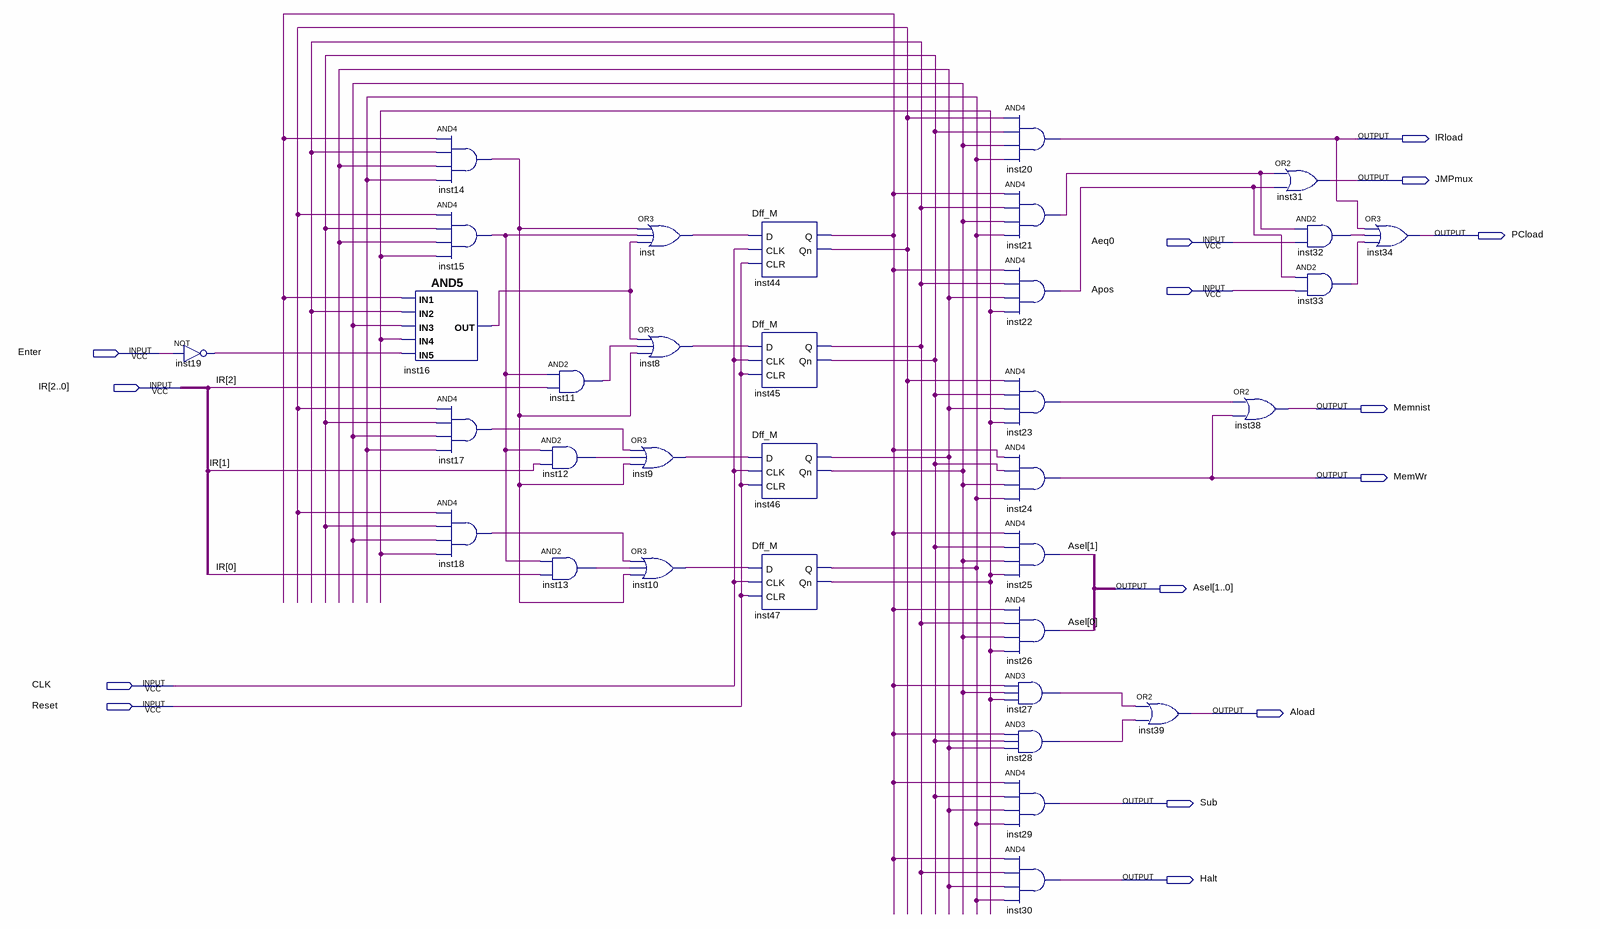
[diagram p0: schematic sheet]
// Quartus schematic CU.bdf as structural Verilog: 34 symbols, 15 pins
module CU (
  input  Aeq0,
  input  Apos,
  input  Enter,
  input  [2:0] IR,
  input  CLK,
  input  Reset,
  output IRload,
  output JMPmux,
  output PCload,
  output Memnist,
  output MemWr,
  output [1:0] Asel,
  output Aload,
  output Sub,
  output Halt
);

  wire inst8_out, inst9_out, inst10_out, inst11_out, inst12_out, inst13_out, inst14_out, inst15_out,
       inst16_out, inst17_out, inst18_out, inst19_out, inst21_out, inst22_out, inst23_out, inst27_out,
       inst28_out, inst32_out, inst33_out, inst44_q, inst44_qn, inst45_q, inst45_qn, inst46_q, inst46_qn,
       inst47_q, inst47_qn, inst_out;

  not inst19 (inst19_out, Enter);
  and inst16 (inst16_out, inst44_q, inst45_q, inst46_qn, inst47_qn, inst19_out);
  and inst14 (inst14_out, inst44_q, inst45_q, inst46_q, inst47_q);
  and inst15 (inst15_out, inst44_qn, inst45_qn, inst46_q, inst47_qn);
  and inst17 (inst17_out, inst44_qn, inst45_qn, inst46_qn, inst47_q);
  and inst18 (inst18_out, inst44_qn, inst45_qn, inst46_qn, inst47_qn);
  and inst11 (inst11_out, inst15_out, IR[2]);
  and inst12 (inst12_out, inst15_out, IR[1]);
  and inst13 (inst13_out, inst15_out, IR[0]);
  or inst (inst_out, inst14_out, inst15_out, inst16_out);
  or inst8 (inst8_out, inst16_out, inst11_out, inst14_out);
  or inst9 (inst9_out, inst17_out, inst12_out, inst14_out);
  or inst10 (inst10_out, inst18_out, inst13_out, inst14_out);
  Dff_M inst44 (.D(inst_out), .CLK(CLK), .CLR(Reset), .Q(inst44_q), .Qn(inst44_qn));
  Dff_M inst45 (.D(inst8_out), .CLK(CLK), .CLR(Reset), .Q(inst45_q), .Qn(inst45_qn));
  Dff_M inst46 (.D(inst9_out), .CLK(CLK), .CLR(Reset), .Q(inst46_q), .Qn(inst46_qn));
  Dff_M inst47 (.D(inst10_out), .CLK(CLK), .CLR(Reset), .Q(inst47_q), .Qn(inst47_qn));
  and inst20 (IRload, inst44_qn, inst45_qn, inst46_qn, inst47_q);
  and inst21 (inst21_out, inst44_q, inst45_q, inst46_qn, inst47_q);
  and inst22 (inst22_out, inst44_q, inst45_q, inst46_q, inst47_qn);
  and inst23 (inst23_out, inst44_qn, inst45_qn, inst46_q, inst47_qn);
  and inst24 (MemWr, inst44_q, inst45_qn, inst46_qn, inst47_q);
  and inst25 (Asel[1], inst44_q, inst45_qn, inst46_qn, inst47_qn);
  and inst26 (Asel[0], inst44_q, inst45_q, inst46_qn, inst47_qn);
  and inst27 (inst27_out, inst44_q, inst46_qn, inst47_qn);
  and inst28 (inst28_out, inst44_q, inst45_qn, inst46_q);
  and inst29 (Sub, inst44_q, inst45_qn, inst46_q, inst47_q);
  and inst30 (Halt, inst44_q, inst45_q, inst46_q, inst47_q);
  or inst39 (Aload, inst27_out, inst28_out);
  or inst38 (Memnist, inst23_out, MemWr);
  or inst31 (JMPmux, inst21_out, inst22_out);
  and inst32 (inst32_out, inst21_out, Aeq0);
  and inst33 (inst33_out, inst22_out, Apos);
  or inst34 (PCload, IRload, inst32_out, inst33_out);
endmodule
